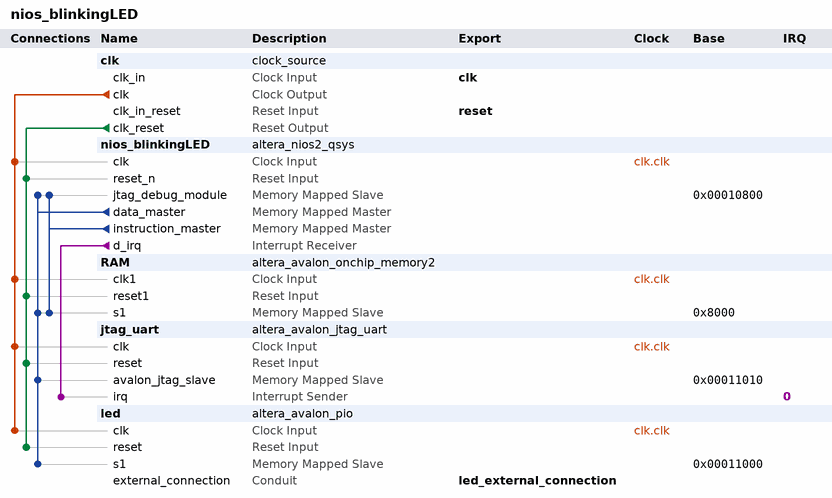
[diagram p0: system contents]
# Platform Designer (Qsys) system nios_blinkingLED
# Parameters at their usual value, and those the tool derives, are not listed.
package require -exact qsys 11.1
create_system nios_blinkingLED
set_project_property DEVICE_FAMILY CYCLONEII

add_instance clk clock_source 11.1
set_instance_parameter_value clk clockFrequency 50000000

add_instance nios_blinkingLED altera_nios2_qsys 11.1
set_instance_parameter_value nios_blinkingLED resetSlave RAM.s1
set_instance_parameter_value nios_blinkingLED exceptionSlave RAM.s1
set_instance_parameter_value nios_blinkingLED breakSlave nios_blinkingLED.jtag_debug_module
set_instance_parameter_value nios_blinkingLED impl Tiny
set_instance_parameter_value nios_blinkingLED icache_size 4096

add_instance RAM altera_avalon_onchip_memory2 11.1
set_instance_parameter_value RAM dataWidth 32
set_instance_parameter_value RAM dualPort false
set_instance_parameter_value RAM initMemContent true
set_instance_parameter_value RAM initializationFileName RAM
set_instance_parameter_value RAM memorySize 20480

add_instance jtag_uart altera_avalon_jtag_uart 11.1
set_instance_parameter_value jtag_uart simInteractiveOptions INTERACTIVE_ASCII_OUTPUT

add_instance led altera_avalon_pio 11.1
set_instance_parameter_value led direction Output
set_instance_parameter_value led width 1

# connections
add_connection clk.clk jtag_uart.clk clock
add_connection clk.clk led.clk clock
add_connection clk.clk nios_blinkingLED.clk clock
add_connection clk.clk RAM.clk1 clock
add_connection clk.clk_reset jtag_uart.reset reset
add_connection clk.clk_reset led.reset reset
add_connection clk.clk_reset nios_blinkingLED.reset_n reset
add_connection clk.clk_reset RAM.reset1 reset
add_connection nios_blinkingLED.data_master jtag_uart.avalon_jtag_slave avalon
set_connection_parameter_value nios_blinkingLED.data_master/jtag_uart.avalon_jtag_slave baseAddress 0x00011010
add_connection nios_blinkingLED.data_master led.s1 avalon
set_connection_parameter_value nios_blinkingLED.data_master/led.s1 baseAddress 0x00011000
add_connection nios_blinkingLED.data_master nios_blinkingLED.jtag_debug_module avalon
set_connection_parameter_value nios_blinkingLED.data_master/nios_blinkingLED.jtag_debug_module baseAddress 0x00010800
add_connection nios_blinkingLED.data_master RAM.s1 avalon
set_connection_parameter_value nios_blinkingLED.data_master/RAM.s1 baseAddress 0x8000
add_connection nios_blinkingLED.instruction_master nios_blinkingLED.jtag_debug_module avalon
set_connection_parameter_value nios_blinkingLED.instruction_master/nios_blinkingLED.jtag_debug_module baseAddress 0x00010800
add_connection nios_blinkingLED.instruction_master RAM.s1 avalon
set_connection_parameter_value nios_blinkingLED.instruction_master/RAM.s1 baseAddress 0x8000
add_connection nios_blinkingLED.d_irq jtag_uart.irq interrupt
set_connection_parameter_value nios_blinkingLED.d_irq/jtag_uart.irq irqNumber 0

# exported interfaces
add_interface clk clock sink
set_interface_property clk EXPORT_OF clk.clk_in
add_interface reset reset sink
set_interface_property reset EXPORT_OF clk.clk_in_reset
add_interface led_external_connection conduit end
set_interface_property led_external_connection EXPORT_OF led.external_connection

save_system nios_blinkingLED.qsys
